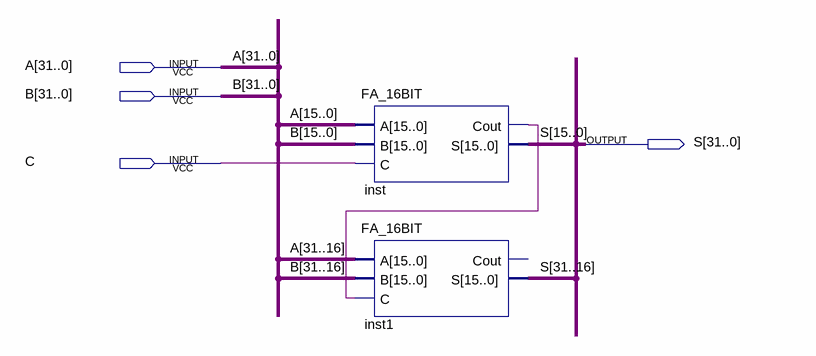
[diagram p0: schematic sheet]
// Quartus schematic ADD_SUB32BIT.bdf as structural Verilog: 2 symbols, 4 pins
module ADD_SUB32BIT (
  input  [31:0] A,
  input  [31:0] B,
  input  C,
  output [31:0] S
);

  wire inst_cout;

  FA_16BIT inst (.A(A[15:0]), .B(B[15:0]), .C(C), .Cout(inst_cout), .S(S[15:0]));
  FA_16BIT inst1 (.A(A[31:16]), .B(B[31:16]), .C(inst_cout), .S(S[31:16]));  // open: Cout
endmodule
